# Altium schematic sheet Car_Driver.SchDoc
size A3
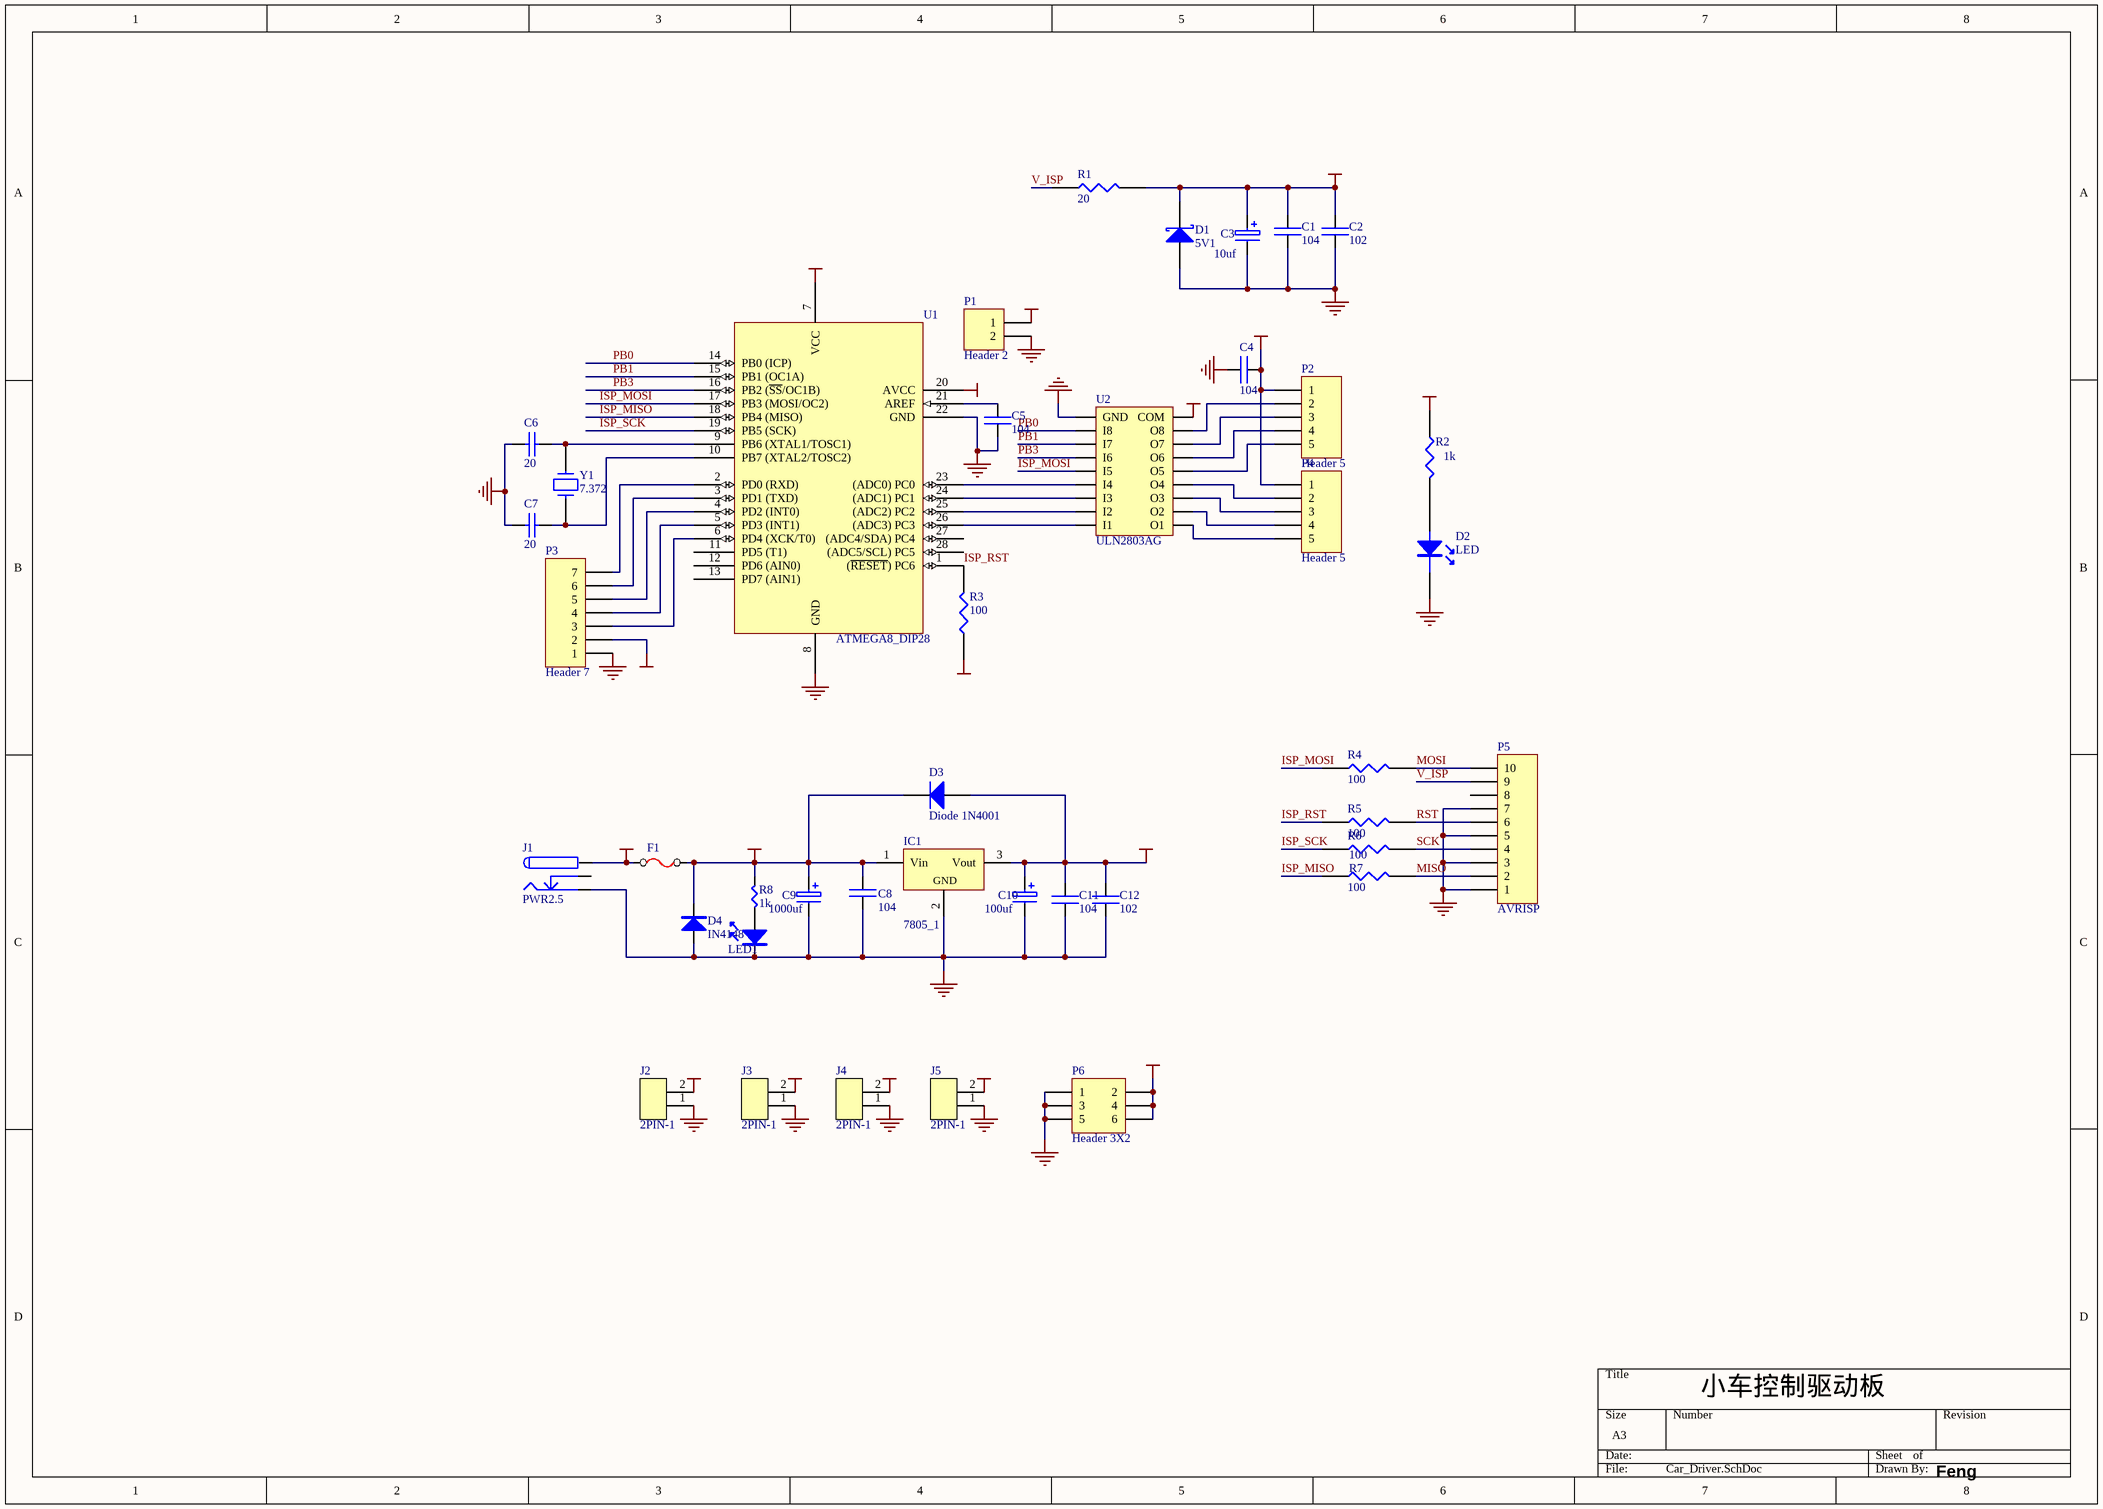
[diagram p0: Car_Driver.SchDoc]

## Parts
C1  104  [CB1]
C2  102  [CB1]
C3  10uf  [10U16]
C4  104  [CB1]
C5  104  [CB1]
C6  20  [CB1]
C7  20  [CB1]
C8  104  [cap_104]
C9  1000uf  [470U25]
C10  100uf  [470U25]
C11  104  [cap_104]
C12  102  [C0.1/0.2]
D1  5V1  [DIODE]
D2  LED  [LED_5]
D3  Diode 1N4001  [diode]
D4  IN4148  [DIODE]
F1  FUSE  [CAP_104]  (value not drawn)
IC1  7805_1  [to-220]
J1  PWR2.5  [DC3]
J2  2PIN-1  [HDR1X2H]
J3  2PIN-1  [HDR1X2H]
J4  2PIN-1  [HDR1X2H]
J5  2PIN-1  [HDR1X2H]
LED1  *  [LED_5]  (value not drawn)
P1  Header 2  [HDR1X2]
P2  Header 5  [HDR1X5]
P3  Header 7  [HDR1X7H]
P4  Header 5  [HDR1X5]
P5  AVRISP  [ISP]
P6  Header 3X2  [HDR2X3]
R1  20  [AXIAL0.4]
R2  1k  [AXIAL0.4]
R3  100  [AXIAL0.4]
R4  100  [AXIAL0.4]
R5  100  [AXIAL0.4]
R6  100  [AXIAL0.4]
R7  100  [AXIAL0.4]
R8  1k  [AXIAL0.4]
U1  ATMEGA8_DIP28  [28P3]
U2  ULN2803AG  [DIP18]
Y1  7.372  [XTAL_US]

## Nets
GND: C1.2 C2.2 C3.2 C4.1 C5.2 C6.1 C7.1 C8.2 C9.2 C10.2 C11.2 C12.2 D1.1(A) D2.2 D4.1 IC1.2(GND) J1.2 J2.1 J3.1 J4.1 J5.1 LED1.2 P1.2 P3.1 P5.1 P5.3 P5.5 P5.7 P6.1 P6.3 P6.5 U1.8(GND) U1.22(GND) U2.9(GND)
V_S: F1.1 J1.1 J2.2 J3.2
VCC: C1.1 C2.1 C3.1 C10.1 C11.1 C12.1 D1.2(K) D3.1(A) IC1.3(Vout) P3.2 P6.2 P6.4 P6.6 R1.2 R2.1 R3.1 U1.7(VCC) U1.20(AVCC)
Vin: C4.2 C8.1 C9.1 D3.2(K) D4.2 F1.2 IC1.1(Vin) J4.2 J5.2 P1.1 P2.1 P4.1 R8.2 U2.10(COM)
ISP_MISO: R7.1 U1.18(PB4_(MISO))
ISP_MOSI: R4.1 U1.17(PB3_(MOSI/OC2)) U2.5(I5)
ISP_RST: R3.2 R5.1 U1.1((~{RESET})_PC6)
ISP_SCK: R6.1 U1.19(PB5_(SCK))
MISO: P5.2 R7.2
MOSI: P5.10 R4.2
PB0: U1.14(PB0_(ICP)) U2.8(I8)
PB1: U1.15(PB1_(OC1A)) U2.7(I7)
PB3: U1.16(PB2_(~{SS}/OC1B)) U2.6(I6)
RST: P5.6 R5.2
SCK: P5.4 R6.2
V_ISP: P5.9 R1.1
NetC5_1: C5.1 U1.21(AREF)
NetC6_2: C6.2 U1.9(PB6_(XTAL1/TOSC1)) Y1.1
NetC7_2: C7.2 U1.10(PB7_(XTAL2/TOSC2)) Y1.2
NetD2_1: D2.1 R2.2
NetLED1_1: LED1.1 R8.1
NetP2_2: P2.2 U2.11(O8)
NetP2_3: P2.3 U2.12(O7)
NetP2_4: P2.4 U2.13(O6)
NetP2_5: P2.5 U2.14(O5)
NetP3_3: P3.3 U1.6(PD4_(XCK/T0))
NetP3_4: P3.4 U1.5(PD3_(INT1))
NetP3_5: P3.5 U1.4(PD2_(INT0))
NetP3_6: P3.6 U1.3(PD1_(TXD))
NetP3_7: P3.7 U1.2(PD0_(RXD))
NetP4_2: P4.2 U2.15(O4)
NetP4_3: P4.3 U2.16(O3)
NetP4_4: P4.4 U2.17(O2)
NetP4_5: P4.5 U2.18(O1)
NetU1_23: U1.23((ADC0)_PC0) U2.4(I4)
NetU1_24: U1.24((ADC1)_PC1) U2.3(I3)
NetU1_25: U1.25((ADC2)_PC2) U2.2(I2)
NetU1_26: U1.26((ADC3)_PC3) U2.1(I1)

Not connected (* = marked no-connect by the designer): J1 3; P5 8; U1 11(PD5_(T1)) 12(PD6_(AIN0)) 13(PD7_(AIN1)) 27((ADC4/SDA)_PC4) 28((ADC5/SCL)_PC5)

## Notes on the sheet
- 小车控制驱动板
- Feng

## Library data of the parts
C1 C2 C4 C5 C8 C11 C12 = E_4
C3 C9 C10 = E_2
C6 C7 = CAP: Capacitor
D1 = D Schottky: Schottky Diode; Published: 8-Jun-2000; LatestRevisionDate: 17-Jul-2002; LatestRevisionNote: Re-released for DXP Platform.; PackageReference: SMB; Publisher: Altium Limited; Code_JEDEC: DO-214-AA
D3 = Diode 1N4001: 1 Amp General Purpose Rectifier; Published: 8-Jun-2000; LatestRevisionDate: 17-Jul-2002; LatestRevisionNote: Re-released for DXP Platform.; DatasheetDocument: 1998; PackageDocument: Aug-1999; PackageReference: DO-41; Publisher: Altium Limited; ComponentLink1Description: Manufacturer Link; ComponentLink1URL: http://www.fairchildsemi.com/; Code_JEDEC: DO-204-AL
J1 = PWR2.5: Low Voltage Power Supply Connector; Published: 17-Dec-2003; DatasheetDocument: 09-May-2002; Publisher: Altium Limited; ComponentLink1Description: Manufacturer Link; ComponentLink1URL: http://domino.kycon.com/internet/Products.html
LED1 = LED_1
P1 = Header 2: Header, 2-Pin; LatestRevisionDate: 17-Jul-2002; LatestRevisionNote: Re-released for DXP Platform.; Publisher: Altium Limited
P2 P4 = Header 5: Header, 5-Pin; LatestRevisionDate: 17-Jul-2002; LatestRevisionNote: Re-released for DXP Platform.; Publisher: Altium Limited
P3 = Header 7: Header, 7-Pin; LatestRevisionDate: 17-Jul-2002; LatestRevisionNote: Re-released for DXP Platform.; Publisher: Altium Limited
P5 = CON10: Connector
P6 = Header 3X2: Header, 3-Pin, Dual row; LatestRevisionDate: 17-Jul-2002; LatestRevisionNote: Re-released for DXP Platform.; Publisher: Altium Limited
R1-R7 = RES1
R8 = R1
U1 = ATMEGA8_DIP28: Atmel Microcontroller - Library created by carel..  <www.mpfreezone.com>
U2 = TD62081
Y1 = CRYSTAL